# Altium schematic sheet Top Level.SchDoc
size A4; DrawnBy: Nick D'Ademo; DocumentNumber: 1; Revision: A; SheetNumber: 1; SheetTotal: 11
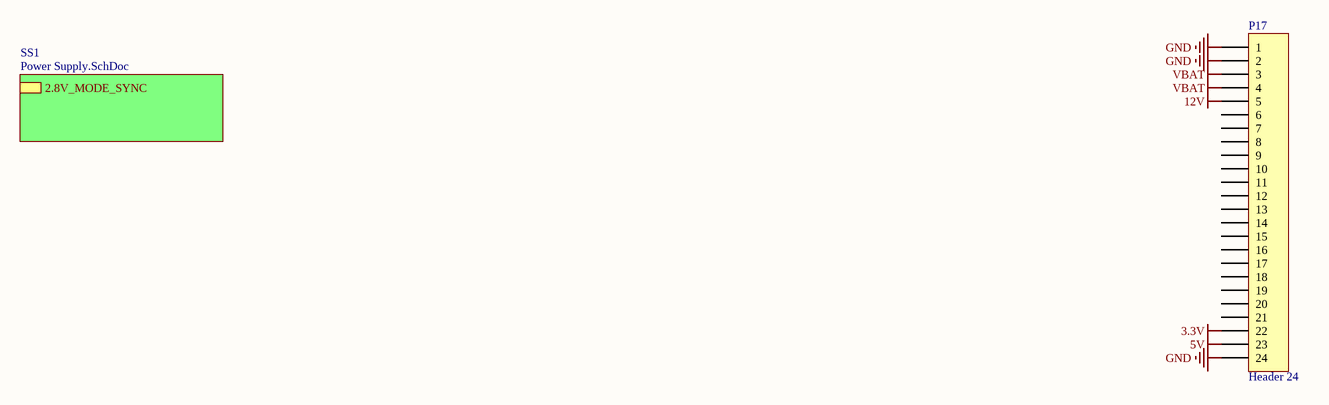
[diagram p0: Top Level.SchDoc]

## Parts
P17  Header 24  [2-1734592-4]

## Sub-sheets
SS1 = Power Supply.SchDoc: 2.8V_MODE_SYNC

## Nets
3.3V: P17.22
5V: P17.23
12V: P17.5
GND: P17.1 P17.2 P17.24
VBAT: P17.3 P17.4

Not connected (* = marked no-connect by the designer): P17 6 7 8 9 10 11 12 13 14 15 16 17 18 19 20 21

## Library data of the parts
P17 = Header 24: GLOBAL CONNECTOR TECHNOLOGY - FFC2B10-24-T - FFC/FPC CONNECTOR, RECEPTACLE, 24POS, 1ROW; LatestRevisionDate: 17-Jul-2002; LatestRevisionNote: Re-released for DXP Platform.; Publisher: Altium Limited